# Altium schematic sheet BoDieuKhienSoXuLyAmThanh.SchDoc
size A
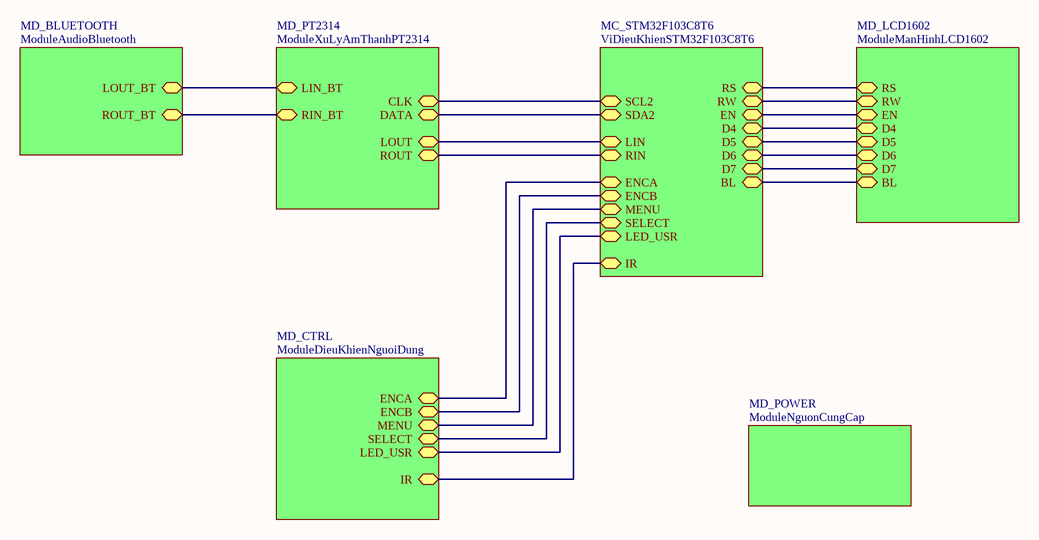
[diagram p0: BoDieuKhienSoXuLyAmThanh.SchDoc]

## Sub-sheets
MC_STM32F103C8T6 = ViDieuKhienSTM32F103C8T6: RS (bidir), RW (bidir), EN (bidir), D4 (bidir), D5 (bidir), D6 (bidir), D7 (bidir), BL (bidir), IR (bidir), SCL2 (bidir), SDA2 (bidir), ENCA (bidir), ENCB (bidir), MENU (bidir), SELECT (bidir), LIN (bidir), RIN (bidir), LED_USR (bidir)
MD_BLUETOOTH = ModuleAudioBluetooth: LOUT_BT (bidir), ROUT_BT (bidir)
MD_CTRL = ModuleDieuKhienNguoiDung: ENCA (bidir), ENCB (bidir), MENU (bidir), SELECT (bidir), IR (bidir), LED_USR (bidir)
MD_LCD1602 = ModuleManHinhLCD1602: RS (bidir), RW (bidir), EN (bidir), D4 (bidir), D5 (bidir), D6 (bidir), D7 (bidir), BL (bidir)
MD_POWER = ModuleNguonCungCap: no entries
MD_PT2314 = ModuleXuLyAmThanhPT2314: LOUT (bidir), ROUT (bidir), DATA (bidir), CLK (bidir), LIN_BT (bidir), RIN_BT (bidir)

## Nets
(unnamed): sheet MD_PT2314/LOUT, sheet MC_STM32F103C8T6/LIN
(unnamed): sheet MD_PT2314/ROUT, sheet MC_STM32F103C8T6/RIN
(unnamed): sheet MD_PT2314/DATA, sheet MC_STM32F103C8T6/SDA2
(unnamed): sheet MD_PT2314/CLK, sheet MC_STM32F103C8T6/SCL2
(unnamed): sheet MD_PT2314/LIN_BT, sheet MD_BLUETOOTH/LOUT_BT
(unnamed): sheet MD_PT2314/RIN_BT, sheet MD_BLUETOOTH/ROUT_BT
(unnamed): sheet MC_STM32F103C8T6/RS, sheet MD_LCD1602/RS
(unnamed): sheet MC_STM32F103C8T6/RW, sheet MD_LCD1602/RW
(unnamed): sheet MC_STM32F103C8T6/EN, sheet MD_LCD1602/EN
(unnamed): sheet MC_STM32F103C8T6/D4, sheet MD_LCD1602/D4
(unnamed): sheet MC_STM32F103C8T6/D5, sheet MD_LCD1602/D5
(unnamed): sheet MC_STM32F103C8T6/D6, sheet MD_LCD1602/D6
(unnamed): sheet MC_STM32F103C8T6/D7, sheet MD_LCD1602/D7
(unnamed): sheet MC_STM32F103C8T6/BL, sheet MD_LCD1602/BL
(unnamed): sheet MC_STM32F103C8T6/IR, sheet MD_CTRL/IR
(unnamed): sheet MC_STM32F103C8T6/ENCA, sheet MD_CTRL/ENCA
(unnamed): sheet MC_STM32F103C8T6/ENCB, sheet MD_CTRL/ENCB
(unnamed): sheet MC_STM32F103C8T6/MENU, sheet MD_CTRL/MENU
(unnamed): sheet MC_STM32F103C8T6/SELECT, sheet MD_CTRL/SELECT
(unnamed): sheet MC_STM32F103C8T6/LED_USR, sheet MD_CTRL/LED_USR